# Altium project HW_ADHERENT_NFC_R1.PrjPcb
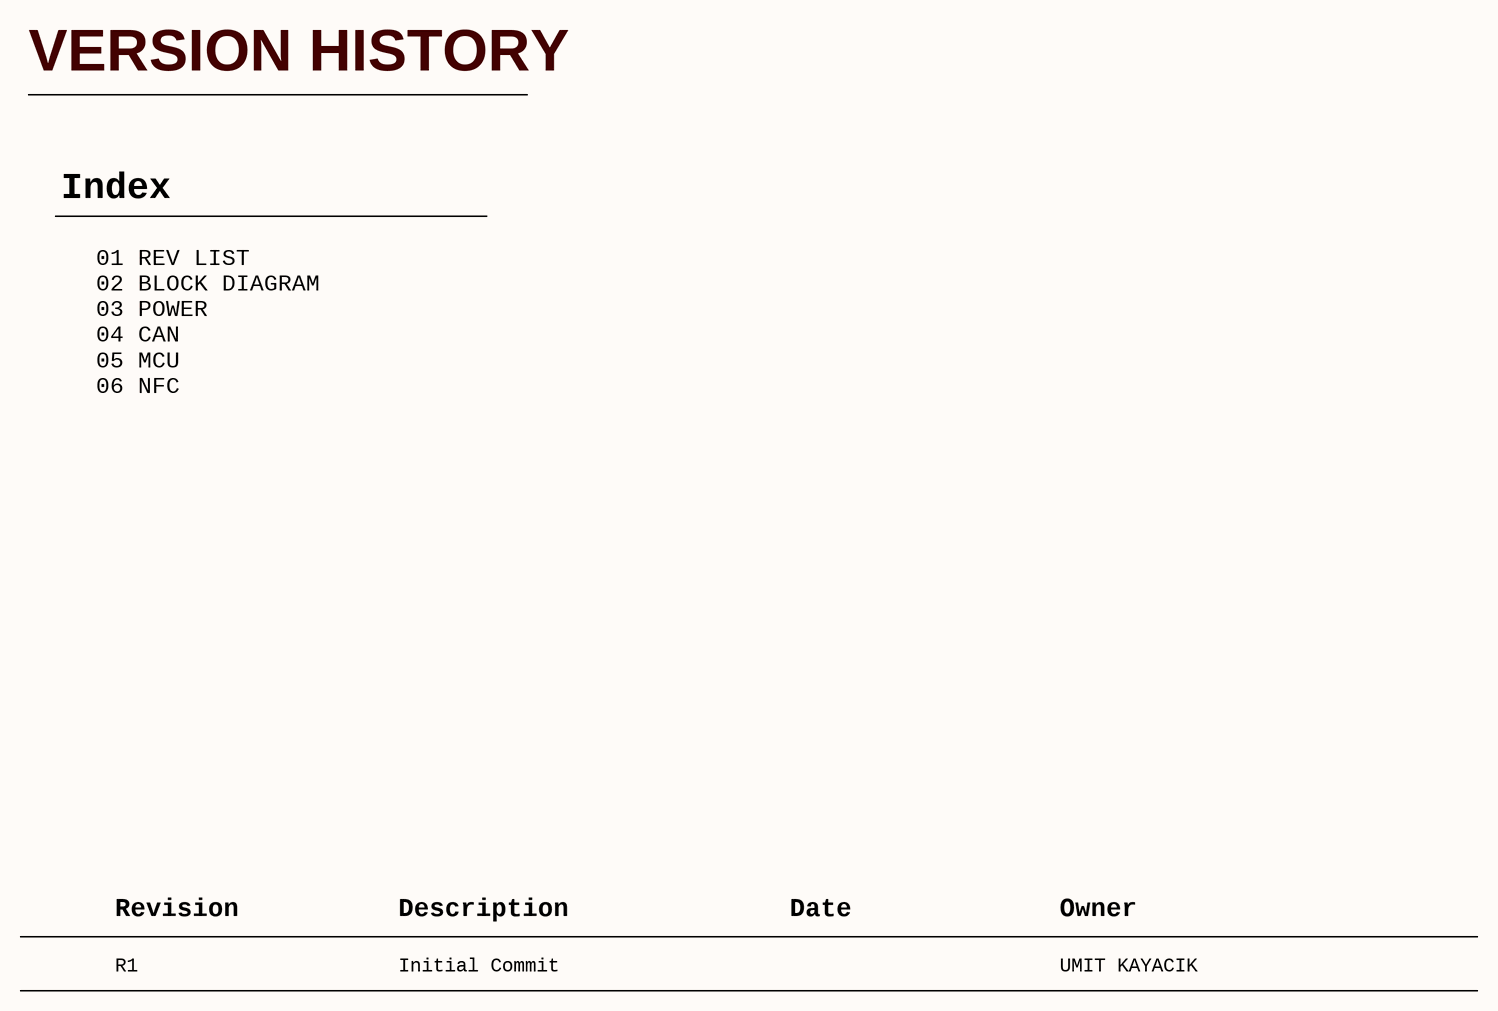
[diagram p0: 01_REVISION_HISTORY.SchDoc]
Project: HW_ADHERENT_NFC_R1; Title: HW_ADHERENT_NFC_R1; TitleParameter: HW_ADHERENT_NFC_R1
5 sheets, 115 parts. Net scope: flat (ports and power ports of the same name join across sheets).
Board file: HW_ADHERENT_NFC_R1.PcbDoc
Sheets:
  01_REVISION_HISTORY.SchDoc
  03_POWER.SchDoc
  04_CAN.SchDoc
  05_MCU.SchDoc
  06_NFC.SchDoc

## Sheet 01_REVISION_HISTORY.SchDoc: HW_ADHERENT_NFC_R1
size A3; Organization: ASISGUARD; Address1: Kemalpasa, Kemalpasa Cd. No:290 D:292H, 35060 Bornova/Izmir/Turkey

### Notes on the sheet
- VERSION HISTORY
- Index
- 01 REV LIST
  02 BLOCK DIAGRAM
  03 POWER
  04 CAN
  05 MCU
  06 NFC
- Revision
- Description
- Date
- Owner
- R1
- Initial Commit
- UMIT KAYACIK
- Proje/Project:
- Sayfa Adı/Document Name:
- Çizilme Tarihi/Drawing Date
- Umit KAYACIK
- Tasarlayan/Designed By
- Sayfa/Sheet:
- Revision:
- of
- Son Güncelleme/Last Edit Date
- Kontrol eden/Checked By
- Onaylayan/Approved By
- Boyut/Size:
- Varyant/Variant:
- Dil/Language:
- A3
- ENG

## Sheet 03_POWER.SchDoc: HW_ADHERENT_NFC_R1
size A3; Organization: ASISGUARD; Address1: Kemalpasa, Kemalpasa Cd. No:290 D:292H, 35060 Bornova/Izmir/Turkey; SheetNumber: 3; SheetTotal: 6
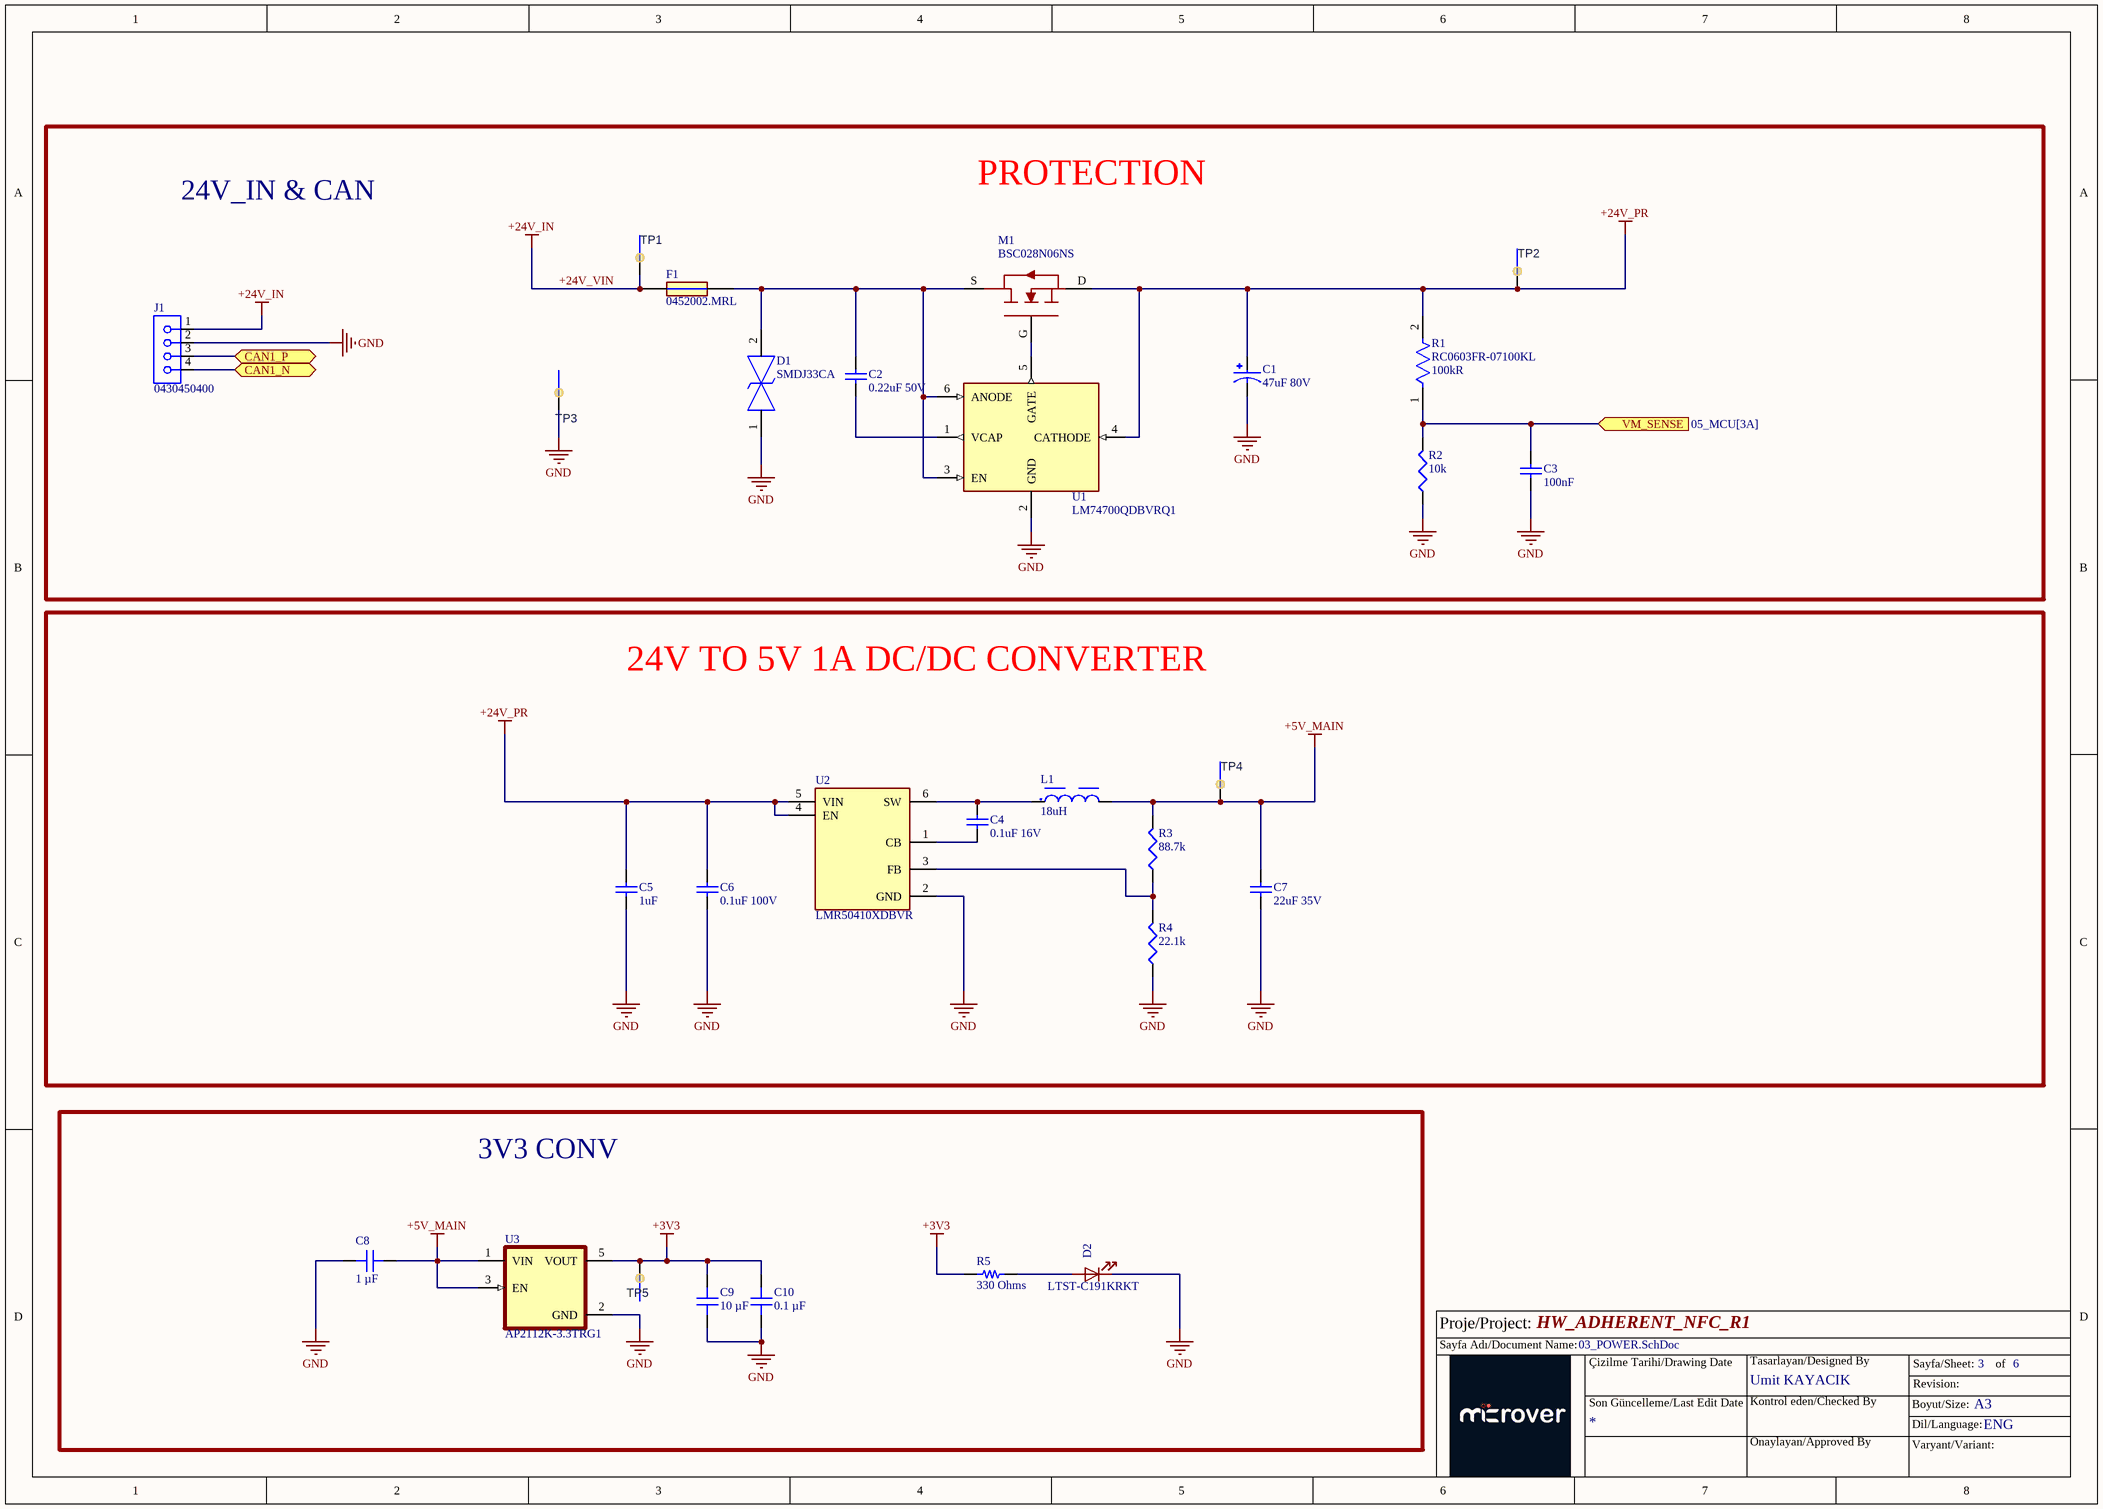
[diagram p1: 03_POWER.SchDoc]

### Parts
C1  47uF 80V  [CAP_EEEFK1K470P]
C2  value 0.22uF 50V  [SMC0603]  (hidden comment: CAP CER 0.22UF 50V X7R 0603)
C3  value 100nF  [CAP0603]  (hidden comment: 100nF 25V)
C4  0.1uF 16V  [CAP0603]
C5  1uF  [CAP0603]
C6  0.1uF 100V  [CAP0603]
C7  22uF 35V  [CAP1206]
C8  1 µF  [CAP 0603_1608]
C9  10 µF  [CAP 0805_2012]
C10  Capacitance: 0.1 µF  [CAP 0603_1608]  (hidden comment: GCM188R71H104KA57J)
D1  SMDJ33CA  [DIONM7959X262N]
D2  LTST-C191KRKT  [LED0603]
F1  0452002.MRL  [FUSC6127X294N]
J1  0430450400  [CONN_SD-43045-001_04_MOL]
L1  18uH  [WE-LQS_6045]
M1  BSC028N06NS  [BSC028N06NS]
R1  RC0603FR-07100KL  Resistance: 100kR  [FP-RC0603-0_55-MFG]
R2  value 10k  [RES0603]  (hidden comment: RES 10K OHM 1% 1/8W 0603)
R3  88.7k  [RES0603]
R4  22.1k  [RES0603]
R5  330 Ohms  [RES 0603_1608]
TP1  Testpoint  [SMD_1P5mm]  (value not drawn)  (no BOM)
TP2  Testpoint  [SMD_1P5mm]  (value not drawn)  (no BOM)
TP3  Testpoint  [SMD_1P5mm]  (value not drawn)  (no BOM)
TP4  Testpoint  [SMD_1P5mm]  (value not drawn)  (no BOM)
TP5  Testpoint  [SMD_1P5mm]  (value not drawn)  (no BOM)
U1  LM74700QDBVRQ1  [SOT95P280X145-6N/LM74700QDBVRQ1]
U2  LMR50410XDBVR  [SOT95P280X145-6N/]
U3  AP2112K-3.3TRG1  [SOT95P285X140-5N]

### Blocks framed on the sheet
PROTECTION: C1-C3 D1 F1 J1 M1 R1 R2 TP1-TP3 U1
24V TO 5V 1A DC/DC CONVERTER: C4-C7 L1 R3 R4 TP4 U2
3V3 CONV: C8-C10 D2 R5 TP5 U3

### Ports
CAN1_N (bidir, see 04_CAN[8B]), CAN1_P (bidir, see 04_CAN[8B]), VM_SENSE (in, see 05_MCU[3A])

### Nets
+3V3: C9.2 C10.2 R5.1 TP5.1(TP) U3.5(VOUT)
+5V_MAIN: C7.2 C8.2 L1.2 R3.2 TP4.1(TP) U3.1(VIN) U3.3(EN)
+24V_PR: C1.1 C5.2 C6.2 M1.D R1.2 TP2.1(TP) U1.4(CATHODE) U2.4(EN) U2.5(VIN)
+24V_VIN: F1.1 J1.1 TP1.1(TP)  [also labelled +24V_IN]
GND: C1.2 C3.1 C5.1 C6.1 C7.1 C8.1 C9.1 C10.1 D1.1 D2.2(K) J1.2 R2.1 R4.1 TP3.1(TP) U1.2(GND) U2.2(GND) U3.2(GND)
CAN1_N: J1.4 ; port CAN1_N
CAN1_P: J1.3 ; port CAN1_P
NetC2_1: C2.1 U1.1(VCAP)
NetC2_2: C2.2 D1.2 F1.2 M1.S U1.3(EN) U1.6(ANODE)
NetC3_2: C3.2 R1.1 R2.2 ; port VM_SENSE
NetC4_1: C4.1 U2.1(CB)
NetC4_2: C4.2 L1.1 U2.6(SW)
NetD2_1: D2.1(A) R5.2
NetM1_G: M1.G U1.5(GATE)
NetR3_1: R3.1 R4.2 U2.3(FB)

### Notes on the sheet
- 24V_IN & CAN
- Proje/Project:
- Sayfa Adı/Document Name:
- Çizilme Tarihi/Drawing Date
- Umit KAYACIK
- Tasarlayan/Designed By
- Sayfa/Sheet:
- Revision:
- of
- Son Güncelleme/Last Edit Date
- Kontrol eden/Checked By
- Onaylayan/Approved By
- Boyut/Size:
- Varyant/Variant:
- Dil/Language:
- A3
- ENG

### Library data of the parts
C1 = EEE-FK1K470P: 47 µF 80 V Aluminum Electrolytic Capacitors Radial, Can - SMD 2000 Hrs @ 105°C; Manufacturer: Panasonic Industry; Supplier: Digi; PCE3831DKR-ND
C2 = CAP0603_0.22UF_50V: 0.22 µF ±10% 50V Ceramic Capacitor X7R 0603 (1608 Metric); Manufacturer Part Number: GCM188R71H224KA64D; Order Code: DIGI: 490-5402-2-ND
C3 = CAP0603_100nF: 0.1 µF ±10% 50V Ceramic Capacitor X7R 0603 (1608 Metric); Manufacturer Part Number: CL10B104KA8NNNC; LCSC Part Number: C1590
C4 = C0603C104M4RACTU: 0.1 µF ±20% 16V Ceramic Capacitor X7R 0603 (1608 Metric); Manifacturer: KEMET; Supplier: Digi; 399-C0603C104M4RACTUDKR-ND
C5 = MSASU168SB5105MTNA01: CAP CER 1UF 50V X5R 0603; Manufacturer: Taiyo Yuden; Supplier: 587-MSASU168SB5105MTNA01DKR-ND
C6 = GRM188R72A104KA35D: CAP CER 0.1UF 100V X7R 0603; Manifacturer: Murata Electronics; Supplier: Digi; 490-3285-6-ND
C7 = CAP1206_22uF_35V: 22 µF ±20% 35V Ceramic Capacitor X5R 1206 (3216 Metric); Manufacturer Part Number: C3216X5R1V226M160AC; Order Code: DIGI : 445-180362-1-ND; Value: 22uF 35V
C8 = GMC10X7R105K25NT: CAP0603 X7R 1UF 10% 25V; manufacturer: Cal-Chip Electronics, Inc.; Part Number: GMC10X7R105K25NT; Capacitance: 1 µF; Applications: General Purpose; componentlink1description: Datasheet; componentlink1url: https://calchip.com/wp-content/uploads/2023/05/gmc_series.pdf; componentlink2description: DigiKey Link; componentlink2url: https://www.digikey.com/en/products/detail/cal-chip-electronics-inc/GMC10X7R105K25NT/22461338; Device Package: 0603 (1608 Metric); lastupdated: 4/6/2026 7:18:33 PM; Lifecycle Status: Active; Minimum Order: 1; Mounting Type: Surface Mount, MLCC; Operating Temperature: -55°C ~ 125°C; Package / Case: 0603 (1608 Metric); packaging: TapeAndReel; partid: 68086; price: 0.01; series: GMC; Size / Dimension: 0.063" L x 0.031" W (1.60mm x 0.80mm); Supplier 1: DigiKey; Supplier Part Number 1: 4713-GMC10X7R105K25NTCT-ND; Temperature Coefficient: X7R; Thickness (Max): 0.037" (0.95mm); Tolerance: ±10%; value: 1 µF; Voltage - Rated: 25V
C9 = GRM21BR61H106KE43L: CAP CER 10UF 50V X5R 0805; manufacturer: Murata Electronics; Tolerance: ±10%; Part Number: GRM21BR61H106KE43L; Capacitance: 10 µF; Applications: Mobile Devices Only; componentlink1description: Datasheet; componentlink1url: https://search.murata.co.jp/Ceramy/image/img/A01X/G101/ENG/GRM21BR61H106KE43-01A.pdf; componentlink2description: DigiKey Link; componentlink2url: https://www.digikey.com/en/products/detail/murata-electronics/GRM21BR61H106KE43L/10326316; Device Package: 0805 (2012 Metric); lastupdated: 4/6/2026 7:32:58 PM; Lifecycle Status: Active; Minimum Order: 1; Mounting Type: Surface Mount, MLCC; Operating Temperature: -55°C ~ 85°C; Package / Case: 0805 (2012 Metric); packaging: TapeAndReel; partid: 39284; Part Status: Active; price: 0.04; series: GRM; Size / Dimension: 0.079" L x 0.049" W (2.00mm x 1.25mm); Supplier 1: DigiKey; Supplier Part Number 1: 490-18663-1-ND; Temperature Coefficient: X5R; Thickness (Max): 0.057" (1.45mm); value: 10 µF; Voltage - Rated: 50V
C10 = GCM188R71H104KA57J: CAP CER 0.1UF 50V X7R 0603; manufacturer: Murata Electronics; Tolerance: ±10%; Part Number: GCM188R71H104KA57J; Applications: Automotive; componentlink1description: Datasheet; componentlink1url: https://psearch.en.murata.com/capacitor/product/GCM188R71H104KA57%23.pdf; componentlink2description: DigiKey Link; componentlink2url: https://www.digikey.com/en/products/detail/murata-electronics/GCM188R71H104KA57J/2591942; Device Package: 0603 (1608 Metric); lastupdated: 4/6/2026 7:22:36 PM; Lifecycle Status: Active; Minimum Order: 1; Mounting Type: Surface Mount, MLCC; Operating Temperature: -55°C ~ 125°C; Package / Case: 0603 (1608 Metric); packaging: TapeAndReel; partid: 60442; Part Status: Not For New Designs; price: 0.03; Ratings: AEC-Q200; series: GCM; Size / Dimension: 0.063" L x 0.031" W (1.60mm x 0.80mm); Supplier 1: DigiKey; Supplier Part Number 1: 490-8020-1-ND; Temperature Coefficient: X7R; Thickness (Max): 0.035" (0.90mm); Voltage - Rated: 50V
D1 = SMDJ33CA: 53.3V Clamp 56.3A Ipp Tvs Diode Surface Mount DO-214AB (SMCJ); Manufacturer: Littelfuse Inc.; Supplier: Digi; SMDJ33CADKR-ND
D2 = LED_1: LED RED CLEAR SMD; Manufacturer: Lite-On Inc.; Value: LTST-C191KRKT; Footprint: LED_SMD:LED_0603_1608Metric; Manufacturer Part Number: LTST-C191KRKT; Supplier Part Number: 160-1447-1-ND
F1 = 0452002.MRL: 2 A 125 V 125 V Fuse Board Mount (Cartridge Style Excluded) Surface Mount 2-SMD, Square End Block; Manufacturer: Littelfuse Inc.; Supplier: Digi; F2602DKR-ND
J1 = 0430450400: Connector Header Through Hole, Right Angle 4 position 0.118" (3.00mm); Manifacturer: MOLEX; Supplier: Digi; WM1814-ND
L1 = 74404064180: 18 µH Semi-Shielded Drum Core, Wirewound Inductor 2.2 A 81mOhm Nonstandard; Supplier: 732-5553-6-ND
M1 = BSC028N06NS: MOSFET'ler N-Ch 60V 100A TDSON-8 OptiMOS 3
R1 = CMP-2100-03662-2: RES SMD 100K OHM 1% 1/10W 0603; Voltage Rating (DC): 50V; Max Power Dissipation: 100mW; Temperature Coefficient: 100ppm/°C; Working Voltage: 75V; Length: 1.6mm; Lead Free: Lead Free; Number of Terminations: 2; Packaging: Tape and Reel; Voltage Rating: 50V; Termination: SMD/SMT; Width: 0.8mm; Resistor Type: Thick Film; Resistance Tolerance: 1%; Features: Moisture Resistant; Height: 0.45mm; Construction: Rectangular; Case/Package: 0603; Military Standard: Not; Case Code (Imperial): 0603; Series: RC; Technology: THICK FILM; Depth: 0.8mm; RoHS Compliant: Yes; REACH SVHC: No SVHC; Min Operating Temperature: -55°C; Case Code (Metric): 1608; Max Operating Temperature: 155°C; Power Rating: 100mW; Number of Pins: 2; Tolerance: 1%
R2 = RES0603_10K_%1_1: 10 kOhms ±1% 0.125W, 1/8W Chip Resistor 0603 (1608 Metric) Anti-Sulfur Thin Film; Manufacturer Part Number: RNCP0603FTD10K0; LCSC Manufacturer Part Number: MCT06030C1002FP500; Order Code: Digi: RNCP0603FTD10K0TR-ND; Sirius Stock Code: *; LCSC Part Number: C161803
R3 = CRCW060388K7FKEA: 88.7 kOhms ±1% 0.125W, 1/8W Chip Resistor 0603 (1608 Metric) Automotive AEC-Q200 Thick Film
R4 = RC0603FR-0722K1L: 22.1 kOhms ±1% 0.1W, 1/10W Chip Resistor 0603 (1608 Metric) Moisture Resistant Thick Film
R5 = CRGH0603F330R: RES SMD 330 OHM 1% 1/5W 0603; Manufacturer: TE Connectivity Passive Product; Power (Watts): 0.2W, 1/5W; Temperature Coefficient: ±100ppm/°C; Part Number: CRGH0603F330R; Value: 330 Ohms; ComponentLink1Description: Datasheet; ComponentLink1URL: https://www.te.com/commerce/DocumentDelivery/DDEController?Action=srchrtrv&DocNm=1773204-1&DocType=DS&DocLang=English; ComponentLink2Description: DigiKey Link; ComponentLink2URL: https://www.digikey.com/en/products/detail/te-connectivity-passive-product/CRGH0603F330R/5586961; Composition: Thick Film; Device Package: 0603 (1608 Metric); Height - Seated (Max): 0.022" (0.55mm); LastUpdated: 2/9/2024 8:43:33 PM; Lifecycle Status: Active; Minimum Order: 1; Number of Terminations: 2; Operating Temperature: -55°C ~ 155°C; Package / Case: 0603 (1608 Metric); Packaging: TapeAndReel; PartId: 5733; Part Status: Active; Price: 0.01; Resistance: 330 Ohms; Series: CRGH, Neohm; Size / Dimension: 0.063" L x 0.031" W (1.60mm x 0.80mm); Supplier 1: DigiKey; Supplier Part Number 1: A129541CT-ND; Supplier Device Package: 0603; Tolerance: ±1%
TP1-TP5 = Testpoint / 1.0mm Pad / TP100: Testpoint / 2.0mm Pad / TP200; Value: Testpoint; DNP: DNP
U1 = LM74700QDBVRQ1: OR Controller N+1 ORing Controller N-Channel 1:1 SOT-23-6
U2 = LMR50410XDBVR: Buck Switching Regulator IC Positive Adjustable 1V 1 Output 1A SOT-23-6; Supplier: 296-LMR50410XDBVRDKR-ND; MPN: LMR50410XDBVR
U3 = AP2112K-3.3TRG1: Linear Voltage Regulator IC Positive Fixed 1 Output 600mA SOT-25; MF: Diodes Inc.; Value: *; Purchase-URL: https://pricing.snapeda.com/search/part/AP2112K-3.3TRG1/?ref=eda; Package: SOT-753 Diodes Inc.; Availability: In Stock; Check_prices: https://www.snapeda.com/parts/AP2112K-3.3TRG1/Diodes+Inc./view-part/?ref=eda; Price: None; SnapEDA_Link: https://www.snapeda.com/parts/AP2112K-3.3TRG1/Diodes+Inc./view-part/?ref=snap; MP: AP2112K-3.3TRG1

## Sheet 04_CAN.SchDoc: HW_ADHERENT_NFC_R1
size A3; Organization: ASISGUARD; Address1: Kemalpasa, Kemalpasa Cd. No:290 D:292H, 35060 Bornova/Izmir/Turkey; SheetNumber: 4; SheetTotal: 6
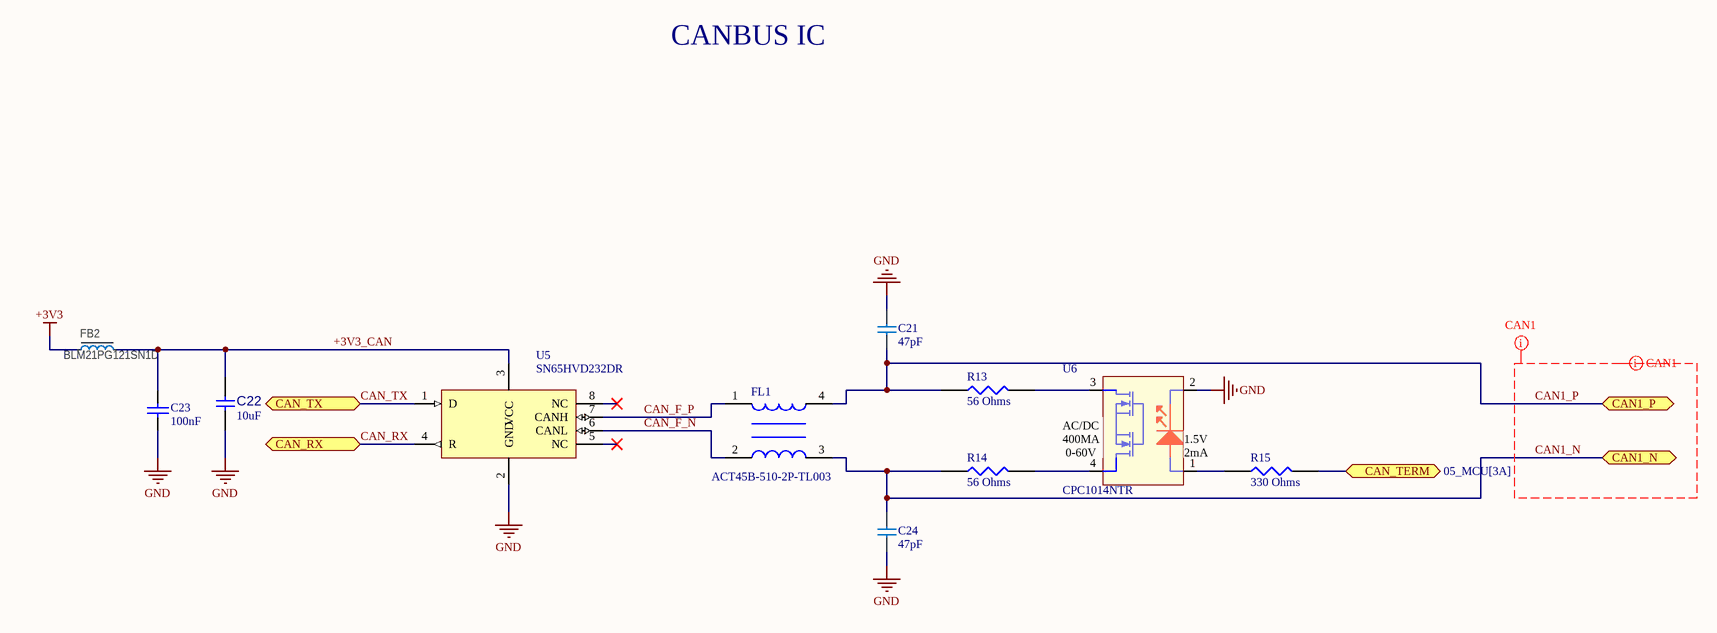
[diagram p2: 04_CAN.SchDoc]

### Parts
C21  47pF  [CAPC1608X100N]
C22  10uF  [0603_C]
C23  100nF  [CAP0603]
C24  47pF  [CAPC1608X100N]
FB2  BLM21PG121SN1D  [INDC2012X11L]
FL1  ACT45B-510-2P-TL003  [FIL_ACT45B-510-2P-TL003]
R13  56 Ohms  [RES_0402]
R14  56 Ohms  [RES_0402]
R15  330 Ohms  [RES_0402]
U5  SN65HVD232DR  [SOIC8]
U6  CPC1014NTR  [4-SOP]

### Ports
CAN1_N (bidir, see 03_POWER[1A]), CAN1_P (bidir, see 03_POWER[1A]), CAN_RX (bidir, see 05_MCU[3A]), CAN_TERM (bidir, see 05_MCU[3A]), CAN_TX (bidir, see 05_MCU[3A])

### Nets
+3V3: FB2.1
GND: C21.2 C22.1 C23.2 C24.1 U5.2(GND) U6.2(CATHODE1)
+3V3_CAN: C22.2 C23.1 FB2.2 U5.3(VCC)
CAN1_N: C24.2 FL1.3 R14.1 ; port CAN1_N
CAN1_P: C21.1 FL1.4 R13.1 ; port CAN1_P
CAN_F_N: FL1.2 U5.6(CANL)
CAN_F_P: FL1.1 U5.7(CANH)
CAN_RX: U5.4(R) ; port CAN_RX
CAN_TX: U5.1(D) ; port CAN_TX
NetR13_2: R13.2 U6.3
NetR14_2: R14.2 U6.4
NetR15_1: R15.1 U6.1(ANODE)
NetR15_2: R15.2 ; port CAN_TERM

Not connected (* = marked no-connect by the designer): U5 5(NC)* 8(NC)*

### Layout directives
net class CAN1: CAN1_N, CAN1_P
differential pair; differential pair class ZDIFF120; net class CAN_BUS: CAN1_N, CAN1_P

### Notes on the sheet
- CANBUS IC
- Proje/Project:
- Sayfa Adı/Document Name:
- Çizilme Tarihi/Drawing Date
- Umit KAYACIK
- Tasarlayan/Designed By
- Sayfa/Sheet:
- Revision:
- of
- Son Güncelleme/Last Edit Date
- Kontrol eden/Checked By
- Onaylayan/Approved By
- Boyut/Size:
- Varyant/Variant:
- Dil/Language:
- A3
- ENG
- (in symbol CPC1014NTR) AC/DC / 400MA / 0-60V; 1.5V / 2mA /

### Library data of the parts
C21 C24 = GMC10CG470F200NT: 47 pF ±1% 200V Ceramic Capacitor C0G, NP0 0603 (1608 Metric); Manufacturer: Cal-Chip Electronics, Inc.; MPN: GMC10CG470F200NT; Supplier: 4713-GMC10CG470F200NTDKR-ND
C22 = CAP1461: CAP CER 10UF 25V X5R 0603; Manufacturer: Murata Electronics North America; Manufacturer Part Number: GRM188R61E106MA73D; Value: 10uF; Voltage: 25V; Revision: 1; Supplier Part Number: 490-7202-1-ND
C23 = CAP0603_100nF: CAP CER 0.1UF 50V X7R 0603; P/N: C0603C104K5RACTU; Value: 100nF 50V; Order Code: DIGI : 399-5089-1-ND
FB2 = FB0402-120R@100M-500mA: Ferrite Bead, 120 Ohm @ 100MHz, 500mA, 250 mOhm Max; Manufacturer: Murata; Manufacturer Part Number: BLM15AG121SN1D; Part number IPS: 00000009954; Part number Norautron: 265230631; Part number NEMS: 100300099; Value: 120R/0.55A; Note: Chip EMIFIL Inductor Type Chip Ferrite Bead; Artikkelnr Noca: 33029317; Pad Count: 2; Component Status: Active; Part Number: FB0402-120R@100M-500mA; Footprint Doc: 0402; LatestRevisionDate: 2014-01-10; Published: 2011-11-14; ComponentLink1Description: Datasheet; ComponentLink2Description: Supplier link; ComponentLink1URL: N.A.; ComponentLink2URL: N.A.; HelpURL: http://search.murata.co.jp/Ceramy/image/img/PDF/ENG/L0110S0100BLM15A_SN.pdf; Supplier 1: Digi-Key; Supplier Part Number 1: 490-1005-1-ND; Supplier 2: Farnell; Supplier Part Number 2: 151-5760; Component Class: Inductors; PartId: 100300099; Author: rsk
FL1 = ACT45B-510-2P-TL003: 51 ÂµH @ 100 kHz 2 Line Common Mode Choke Surface Mount 2.8 kOhms @ 10 MHz 200mA DCR 1Ohm; MF: TDK; SnapEDA_Link: https://www.snapeda.com/parts/ACT45B-510-2P-TL003/TDK/view-part/?ref=snap; Package: Horizontal-4 TDK; Value: *; MP: ACT45B-510-2P-TL003; Check_prices: https://www.snapeda.com/parts/ACT45B-510-2P-TL003/TDK/view-part/?ref=eda
R13 R14 = RMCF0402FT56R0: 56 Ohms ±1% 0.063W, 1/16W Chip Resistor 0402 (1005 Metric) Automotive AEC-Q200 Thick Film; Manİfacturer: Stackpole Electronics Inc; Supplier: Digi; RMCF0402FT56R0DKR-ND
R15 = RMCF0402FT330R: 330 Ohms ±1% 0.063W, 1/16W Chip Resistor 0402 (1005 Metric) Automotive AEC-Q200 Thick Film; Manifacturer: Stackpole Electronics Inc; Supplier: Digi; RMCF0402FT330RDKR-ND
U5 = SN65HVD232DR: 1Mbps Transceiver 3V~3.6V SOIC-8 CAN ICs ROHS; Manufacturer Part Number: SN65HVD232DR; LCSC Part Number: C30530
U6 = CPC1014NTR: SSR RELAY SPST-NO 400MA 0-60V; Manufacturer: IXYS Integrated Circuits Division; Manufacturer Part Number: CPC1014NTR; Supplier Part Number: CLA314CT-ND

## Sheet 05_MCU.SchDoc: HW_ADHERENT_NFC_R1
size A3; Organization: ASISGUARD; Address1: Kemalpasa, Kemalpasa Cd. No:290 D:292H, 35060 Bornova/Izmir/Turkey; SheetNumber: 5; SheetTotal: 6
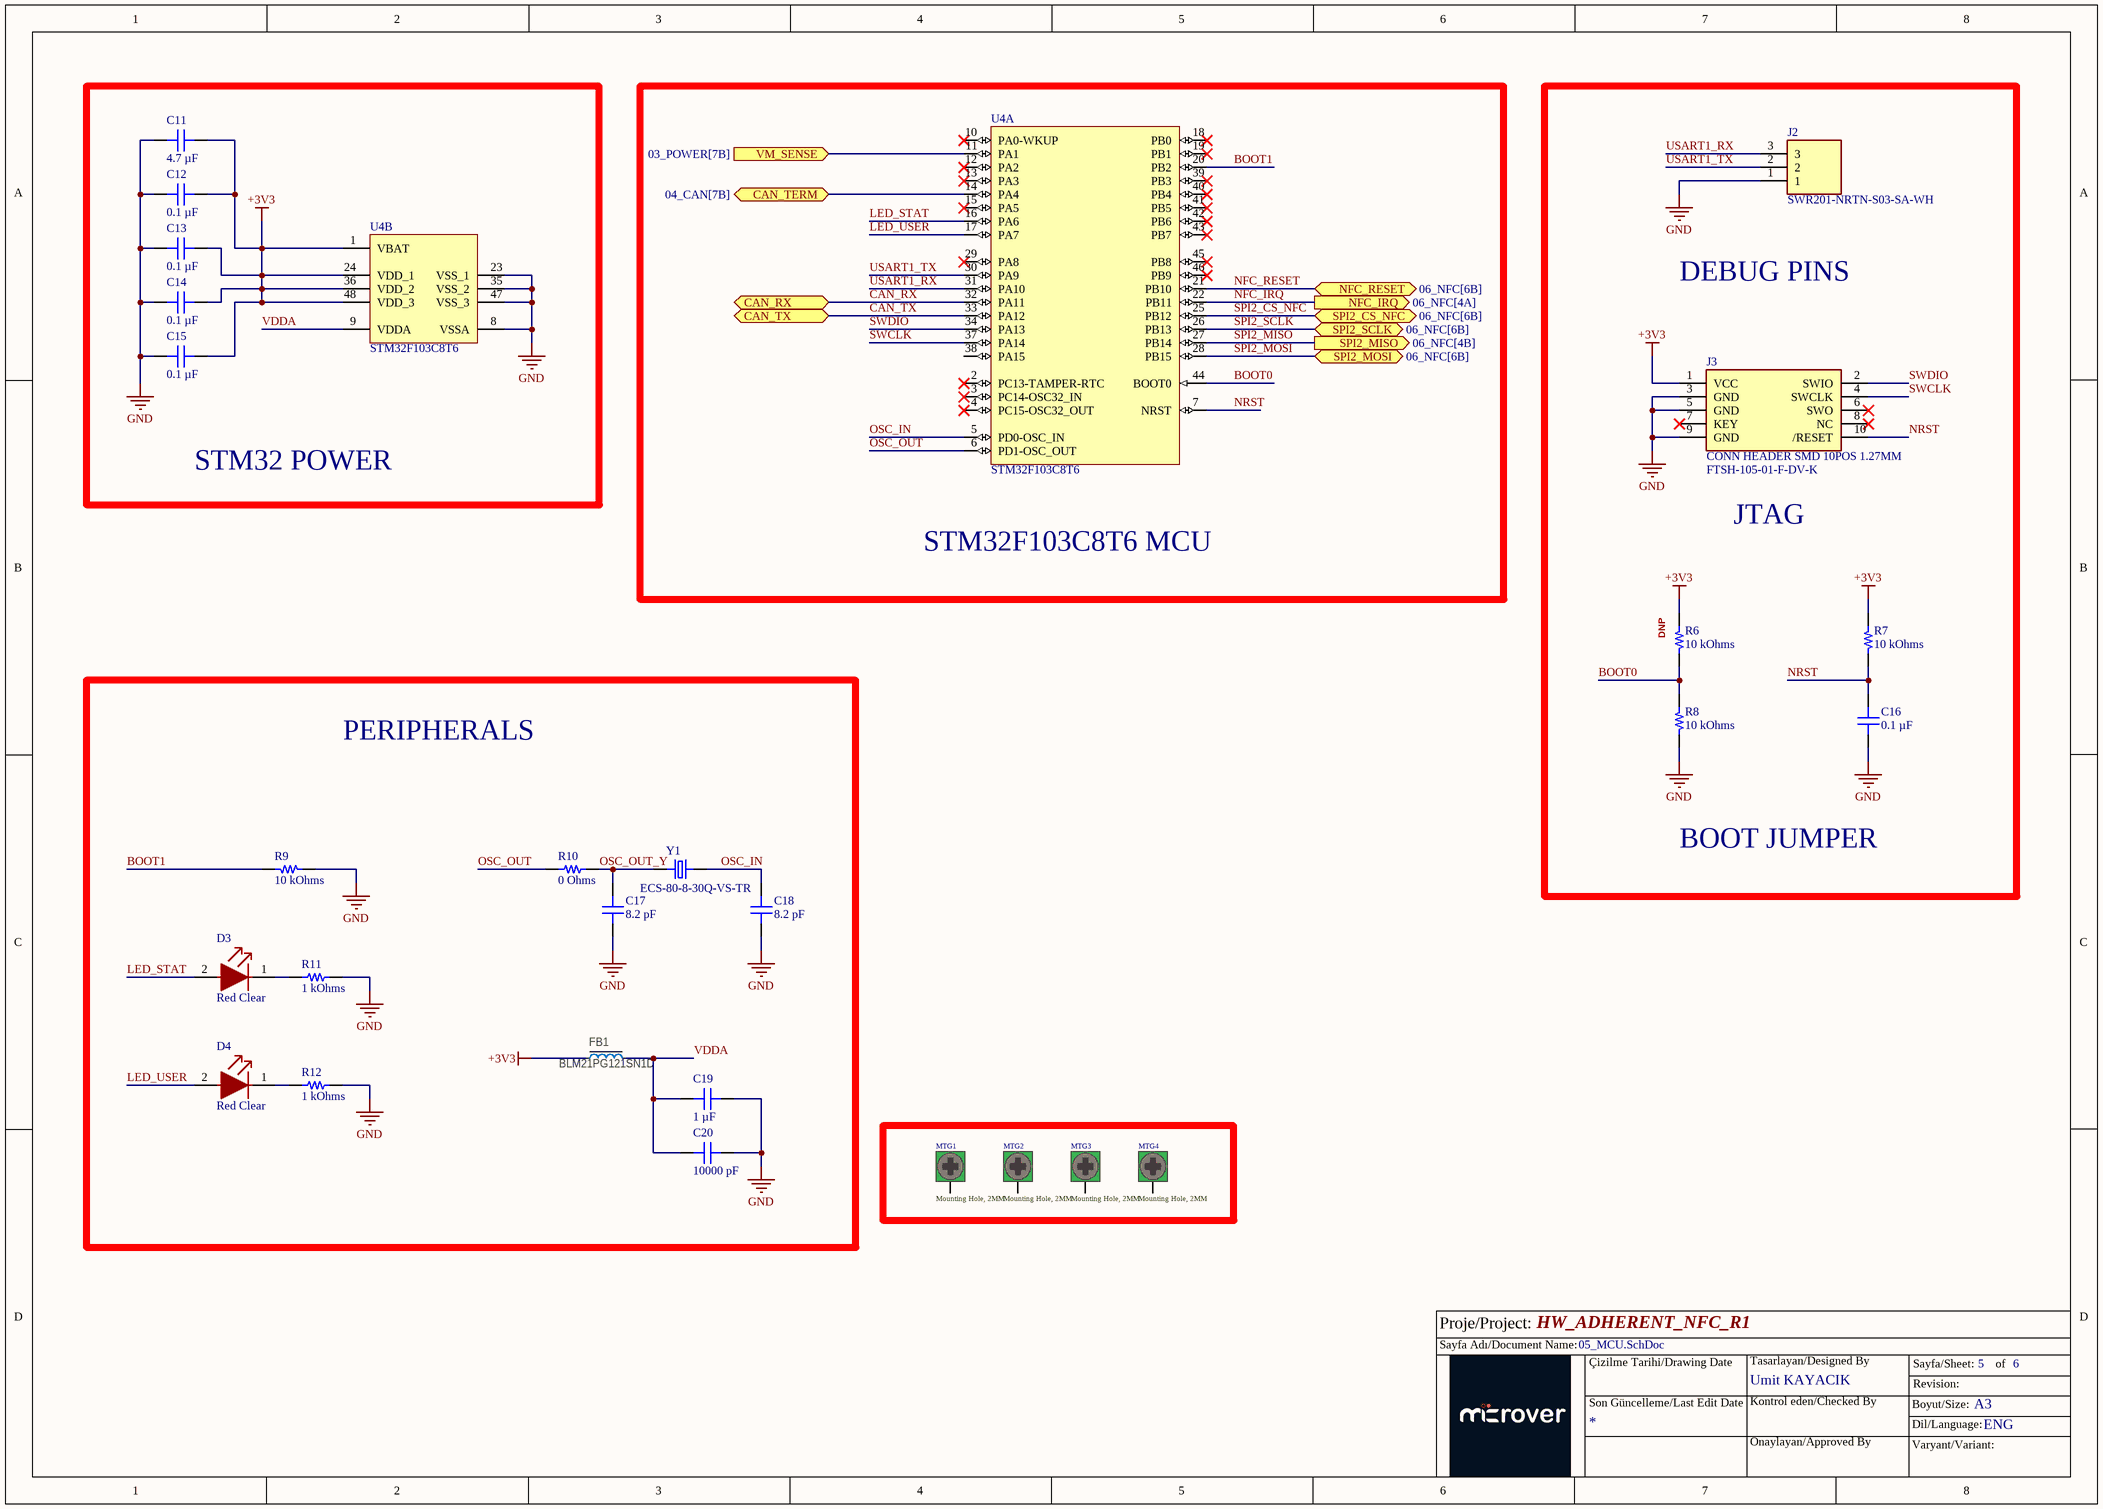
[diagram p3: 05_MCU.SchDoc]

### Parts
C11  4.7 µF  [CAP 0805_2012]
C12  Capacitance: 0.1 µF  [CAP 0603_1608]  (hidden comment: GCM188R71H104KA57J)
C13  Capacitance: 0.1 µF  [CAP 0603_1608]  (hidden comment: GCM188R71H104KA57J)
C14  Capacitance: 0.1 µF  [CAP 0603_1608]  (hidden comment: GCM188R71H104KA57J)
C15  Capacitance: 0.1 µF  [CAP 0603_1608]  (hidden comment: GCM188R71H104KA57J)
C16  Capacitance: 0.1 µF  [CAP 0603_1608]  (hidden comment: GCM188R71H104KA57J)
C17  8.2 pF  [CAP 0402_1005]
C18  8.2 pF  [CAP 0402_1005]
C19  1 µF  [CAP 0603_1608]
C20  10000 pF  [CAP 0603_1608]
D3  Color: Red Clear  [Lite-On_RED_0603]  (hidden comment: LED RED CLEAR SMD)
D4  Color: Red Clear  [Lite-On_RED_0603]  (hidden comment: LED RED CLEAR SMD)
FB1  BLM21PG121SN1D  [INDC2012X11L]
J2  SWR201-NRTN-S03-SA-WH  [SHDR3W50P0X200_1X3_790X460X630P]
J3  CONN HEADER SMD 10POS 1.27MM  [Samtec_0_MFG]
MTG1  Mounting Hole, 2MM  [MTG-PTH-2MM]  (no BOM)
MTG2  Mounting Hole, 2MM  [MTG-PTH-2MM]  (no BOM)
MTG3  Mounting Hole, 2MM  [MTG-PTH-2MM]  (no BOM)
MTG4  Mounting Hole, 2MM  [MTG-PTH-2MM]  (no BOM)
R6  10 kOhms  [RES 0402_1005]
R7  10 kOhms  [RES 0402_1005]
R8  10 kOhms  [RES 0402_1005]
R9  10 kOhms  [RES 0402_1005]
R10  0 Ohms  [RES 0402_1005]
R11  1 kOhms  [RES 0402_1005]
R12  1 kOhms  [RES 0402_1005]
U4  STM32F103C8T6  [LQFP48_STM]  (parts A,B of 2)
Y1  ECS-80-8-30Q-VS-TR  [XTAL_ECS-80-8-30Q-VS-TR]

### Blocks framed on the sheet
STM32 POWER: C11-C15 U4
STM32F103C8T6 MCU: U4
PERIPHERALS: C17-C20 D3 D4 FB1 R9-R12 Y1

### Ports
CAN_RX (bidir, see 04_CAN[2B]), CAN_TERM (bidir, see 04_CAN[7B]), CAN_TX (bidir, see 04_CAN[2B]), NFC_IRQ (out, see 06_NFC[4A]), NFC_RESET (bidir, see 06_NFC[6B]), SPI2_CS_NFC (bidir, see 06_NFC[6B]), SPI2_MISO (out, see 06_NFC[4B]), SPI2_MOSI (bidir, see 06_NFC[6B]), SPI2_SCLK (bidir, see 06_NFC[6B]), VM_SENSE (in, see 03_POWER[7B])

### Nets
+3V3: C11.2 C12.1 C13.1 C14.1 C15.1 FB1.1 J3.1(VCC) R6.1 R7.1 U4.1(VBAT) U4.24(VDD_1) U4.36(VDD_2) U4.48(VDD_3)
GND: C11.1 C12.2 C13.2 C14.2 C15.2 C16.2 C17.1 C18.1 C19.2 C20.2 J2.1 J3.3(GND) J3.5(GND) J3.9(GND) R8.2 R9.1 R11.2 R12.2 U4.8(VSSA) U4.23(VSS_1) U4.35(VSS_2) U4.47(VSS_3)
BOOT0: R6.2 R8.1 U4.44(BOOT0)
BOOT1: R9.2 U4.20(PB2)
CAN_RX: U4.32(PA11) ; port CAN_RX
CAN_TX: U4.33(PA12) ; port CAN_TX
LED_STAT: D3.2(A) U4.16(PA6)
LED_USER: D4.2(A) U4.17(PA7)
NFC_IRQ: U4.22(PB11) ; port NFC_IRQ
NFC_RESET: U4.21(PB10) ; port NFC_RESET
NRST: C16.1 J3.10(/RESET) R7.2 U4.7(NRST)
OSC_IN: C18.2 U4.5(PD0-OSC_IN) Y1.2(OUT/IN)
OSC_OUT: R10.1 U4.6(PD1-OSC_OUT)
OSC_OUT_Y: C17.2 R10.2 Y1.1(IN/OUT)
SPI2_CS_NFC: U4.25(PB12) ; port SPI2_CS_NFC
SPI2_MISO: U4.27(PB14) ; port SPI2_MISO
SPI2_MOSI: U4.28(PB15) ; port SPI2_MOSI
SPI2_SCLK: U4.26(PB13) ; port SPI2_SCLK
SWCLK: J3.4(SWCLK) U4.37(PA14)
SWDIO: J3.2(SWIO) U4.34(PA13)
USART1_RX: J2.3 U4.31(PA10)
USART1_TX: J2.2 U4.30(PA9)
VDDA: C19.1 C20.1 FB1.2 U4.9(VDDA)
NetC3_2: U4.11(PA1) ; port VM_SENSE
NetD3_1: D3.1(C) R11.1
NetD4_1: D4.1(C) R12.1
NetR15_2: U4.14(PA4) ; port CAN_TERM

Not connected (* = marked no-connect by the designer): J3 6(SWO)* 7(KEY)* 8(NC)*; MTG1 0; MTG2 0; MTG3 0; MTG4 0; U4 2(PC13-TAMPER-RTC)* 3(PC14-OSC32_IN)* 4(PC15-OSC32_OUT)* 10(PA0-WKUP)* 12(PA2)* 13(PA3)* 15(PA5)* 18(PB0)* 19(PB1)* 29(PA8)* 38(PA15) 39(PB3)* 40(PB4)* 41(PB5)* 42(PB6)* 43(PB7)* 45(PB8)* 46(PB9)*

### Notes on the sheet
- DEBUG PINS
- JTAG
- (near R6) DNP
- BOOT JUMPER
- Proje/Project:
- Sayfa Adı/Document Name:
- Çizilme Tarihi/Drawing Date
- Umit KAYACIK
- Tasarlayan/Designed By
- Sayfa/Sheet:
- Revision:
- of
- Son Güncelleme/Last Edit Date
- Kontrol eden/Checked By
- Onaylayan/Approved By
- Boyut/Size:
- Varyant/Variant:
- Dil/Language:
- A3
- ENG

### Library data of the parts
C11 = GRM21BZ71H475KE15K: CAP CER 4.7UF 50V X7R 0805; manufacturer: Murata Electronics; Tolerance: ±10%; Part Number: GRM21BZ71H475KE15K; Capacitance: 4.7 µF; Applications: General Purpose; componentlink1description: Datasheet; componentlink1url: https://search.murata.co.jp/Ceramy/image/img/A01X/G101/ENG/GRM21BZ71H475KE15-01.pdf; componentlink2description: DigiKey Link; componentlink2url: https://www.digikey.com/en/products/detail/murata-electronics/GRM21BZ71H475KE15K/13904908; Device Package: 0805 (2012 Metric); lastupdated: 6.04.2026 19:31:51; Lifecycle Status: Active; Minimum Order: 1; Mounting Type: Surface Mount, MLCC; Operating Temperature: -55°C ~ 125°C; Package / Case: 0805 (2012 Metric); packaging: TapeAndReel; partid: 39591; Part Status: Active; price: 0.17; series: GRM; Size / Dimension: 0.079" L x 0.049" W (2.00mm x 1.25mm); Supplier 1: DigiKey; Supplier Part Number 1: 490-GRM21BZ71H475KE15KCT-ND; Temperature Coefficient: X7R; Thickness (Max): 0.057" (1.45mm); value: 4.7 µF; Voltage - Rated: 50V
C12-C16 = GCM188R71H104KA57J: as C10 on sheet 03_POWER; Part Number: GCM188R71H104KA57J; Applications: Automotive; componentlink1description: Datasheet; componentlink1url: https://psearch.en.murata.com/capacitor/product/GCM188R71H104KA57%23.pdf; componentlink2description: DigiKey Link; componentlink2url: https://www.digikey.com/en/products/detail/murata-electronics/GCM188R71H104KA57J/2591942; Device Package: 0603 (1608 Metric); lastupdated: 6.04.2026 19:22:36; Lifecycle Status: Active; Minimum Order: 1; Mounting Type: Surface Mount, MLCC; Operating Temperature: -55°C ~ 125°C; Package / Case: 0603 (1608 Metric); packaging: TapeAndReel; partid: 60442; Part Status: Not For New Designs; price: 0.03; Ratings: AEC-Q200; series: GCM; Size / Dimension: 0.063" L x 0.031" W (1.60mm x 0.80mm); Supplier 1: DigiKey; Supplier Part Number 1: 490-8020-1-ND; Temperature Coefficient: X7R; Thickness (Max): 0.035" (0.90mm); Voltage - Rated: 50V
C17 C18 = GMC04CG8R2J25NT: CAP0402 COG 8.2PF 5% 25V; manufacturer: Cal-Chip Electronics, Inc.; Temperature Coefficient: C0G, NP0; Part Number: GMC04CG8R2J25NT; Capacitance: 8.2 pF; Applications: General Purpose; componentlink1description: Datasheet; componentlink1url: https://calchip.com/wp-content/uploads/2025/05/GMC-Series-3.pdf; componentlink2description: DigiKey Link; componentlink2url: https://www.digikey.com/en/products/detail/cal-chip-electronics-inc/GMC04CG8R2J25NT/27784357; Device Package: 0402 (1005 Metric); Features: General Purpose; lastupdated: 6.04.2026 19:06:51; Lifecycle Status: Active; Minimum Order: 1; Mounting Type: Surface Mount, MLCC; Operating Temperature: -55°C ~ 125°C; Package / Case: 0402 (1005 Metric); packaging: TapeAndReel; partid: 61382; price: 0.07; series: GMC; Size / Dimension: 0.039" L x 0.020" W (1.00mm x 0.50mm); Supplier 1: DigiKey; Supplier Part Number 1: 4713-GMC04CG8R2J25NTCT-ND; Thickness (Max): 0.022" (0.55mm); Tolerance: ±5%; value: 8.2 pF; Voltage - Rated: 25V
C19 = GMC10X7R105K25NT: as C8 on sheet 03_POWER; Part Number: GMC10X7R105K25NT; Capacitance: 1 µF; Applications: General Purpose; componentlink1description: Datasheet; componentlink1url: https://calchip.com/wp-content/uploads/2023/05/gmc_series.pdf; componentlink2description: DigiKey Link; componentlink2url: https://www.digikey.com/en/products/detail/cal-chip-electronics-inc/GMC10X7R105K25NT/22461338; Device Package: 0603 (1608 Metric); lastupdated: 6.04.2026 19:18:33; Lifecycle Status: Active; Minimum Order: 1; Mounting Type: Surface Mount, MLCC; Operating Temperature: -55°C ~ 125°C; Package / Case: 0603 (1608 Metric); packaging: TapeAndReel; partid: 68086; price: 0.01; series: GMC; Size / Dimension: 0.063" L x 0.031" W (1.60mm x 0.80mm); Supplier 1: DigiKey; Supplier Part Number 1: 4713-GMC10X7R105K25NTCT-ND; Temperature Coefficient: X7R; Thickness (Max): 0.037" (0.95mm); Tolerance: ±10%; value: 1 µF; Voltage - Rated: 25V
C20 = C0603C103K4RECTU: CAP CER 0603 10NF 16V X7R 10%; manufacturer: KEMET; Part Number: C0603C103K4RECTU; Capacitance: 10000 pF; Applications: ESD Protection; componentlink1description: Datasheet; componentlink1url: https://search.kemet.com/download/datasheet/C0603C103K4REC7867; componentlink2description: DigiKey Link; componentlink2url: https://www.digikey.com/en/products/detail/kemet/C0603C103K4RECTU/8643658; Device Package: 0603 (1608 Metric); lastupdated: 6.04.2026 19:17:55; Lifecycle Status: Active; Minimum Order: 1; Mounting Type: Surface Mount, MLCC; Operating Temperature: -55°C ~ 125°C; Package / Case: 0603 (1608 Metric); packaging: TapeAndReel; partid: 66152; price: 0.01; series: ESD SMD Comm X7R; Size / Dimension: 0.063" L x 0.031" W (1.60mm x 0.80mm); Supplier 1: DigiKey; Supplier Part Number 1: 399-C0603C103K4RECTUCT-ND; Temperature Coefficient: X7R; Thickness (Max): 0.034" (0.87mm); Tolerance: ±10%; value: 10000 pF; Voltage - Rated: 16V
D3 D4 = LTST-C191KRKT_2: Red 631nm LED Indication - Discrete 2V 0603 (1608 Metric); Manufacturer: Lite-On Inc.; Order Code: DIGI: 160-1447-2-ND; Manufacturer Part Number: LTST-C191KRKT
FB1 = FB0402-120R@100M-500mA: as FB2 on sheet 04_CAN; Part Number: FB0402-120R@100M-500mA; Footprint Doc: 0402; LatestRevisionDate: 2014-01-10; Published: 2011-11-14; ComponentLink1Description: Datasheet; ComponentLink2Description: Supplier link; ComponentLink1URL: N.A.; ComponentLink2URL: N.A.; HelpURL: http://search.murata.co.jp/Ceramy/image/img/PDF/ENG/L0110S0100BLM15A_SN.pdf; Supplier 1: Digi-Key; Supplier Part Number 1: 490-1005-1-ND; Supplier 2: Farnell; Supplier Part Number 2: 151-5760; Component Class: Inductors; PartId: 100300099; Author: rsk
J2 = SWR201-NRTN-S03-SA-WH: Connector; Manufacturer_Name: Sullins; Datasheet Link: https://drawings-pdf.s3.amazonaws.com/11623.pdf; Height: 6.3mm; Manufacturer_Part_Number: SWR201-NRTN-S03-SA-WH
J3 = FTSH-105-01-F-DV-K: Connector Header Surface Mount 10 position 0.050" (1.27mm); Order Code: DIGI: SAM8796-ND; Manufacturer Part Number: FTSH-105-01-F-DV-K
MTG1-MTG4 = MTG2MM
R6-R9 = RMCF0402FT10K0: RES 10K OHM 1% 1/16W 0402; Manufacturer: Stackpole Electronics Inc; Power (Watts): 0.063W, 1/16W; Temperature Coefficient: ±100ppm/°C; Part Number: RMCF0402FT10K0; Value: 10 kOhms; ComponentLink1Description: Datasheet; ComponentLink1URL: https://www.seielect.com/catalog/sei-rmcf_rmcp.pdf; ComponentLink2Description: DigiKey Link; ComponentLink2URL: https://www.digikey.com/en/products/detail/stackpole-electronics-inc/RMCF0402FT10K0/1761433; Composition: Thick Film; Device Package: 0402 (1005 Metric); Features: Automotive AEC-Q200; Height - Seated (Max): 0.016" (0.40mm); LastUpdated: 9.02.2024 20:29:20; Lifecycle Status: Active; Minimum Order: 1; Number of Terminations: 2; Operating Temperature: -55°C ~ 155°C; Package / Case: 0402 (1005 Metric); Packaging: CutTape; PartId: 20541; Part Status: Active; Price: 0.01; Ratings: AEC-Q200; Resistance: 10 kOhms; Series: RMCF; Size / Dimension: 0.039" L x 0.020" W (1.00mm x 0.50mm); Supplier 1: DigiKey; Supplier Part Number 1: RMCF0402FT10K0CT-ND; Supplier Device Package: 0402; Tolerance: ±1%
R10 = RMCF0402ZT0R00: RES 0 OHM JUMPER 1/16W 0402; Manufacturer: Stackpole Electronics Inc; Power (Watts): 0.063W, 1/16W; Part Number: RMCF0402ZT0R00; Value: 0 Ohms; ComponentLink1Description: Datasheet; ComponentLink1URL: https://www.seielect.com/catalog/sei-rmcf_rmcp.pdf; ComponentLink2Description: DigiKey Link; ComponentLink2URL: https://www.digikey.com/en/products/detail/stackpole-electronics-inc/RMCF0402ZT0R00/1756905; Composition: Thick Film; Device Package: 0402 (1005 Metric); Features: Automotive AEC-Q200; Height - Seated (Max): 0.016" (0.40mm); LastUpdated: 9.02.2024 20:29:34; Lifecycle Status: Active; Minimum Order: 1; Number of Terminations: 2; Operating Temperature: -55°C ~ 155°C; Package / Case: 0402 (1005 Metric); Packaging: CutTape; PartId: 17627; Part Status: Active; Price: 0.01; Ratings: AEC-Q200; Resistance: 0 Ohms; Series: RMCF; Size / Dimension: 0.039" L x 0.020" W (1.00mm x 0.50mm); Supplier 1: DigiKey; Supplier Part Number 1: RMCF0402ZT0R00CT-ND; Supplier Device Package: 0402; Tolerance: Jumper
R11 R12 = RMCF0402FT1K00: RES 1K OHM 1% 1/16W 0402; Manufacturer: Stackpole Electronics Inc; Power (Watts): 0.063W, 1/16W; Temperature Coefficient: ±100ppm/°C; Part Number: RMCF0402FT1K00; Value: 1 kOhms; ComponentLink1Description: Datasheet; ComponentLink1URL: https://www.seielect.com/catalog/sei-rmcf_rmcp.pdf; ComponentLink2Description: DigiKey Link; ComponentLink2URL: https://www.digikey.com/en/products/detail/stackpole-electronics-inc/RMCF0402FT1K00/1761754; Composition: Thick Film; Device Package: 0402 (1005 Metric); Features: Automotive AEC-Q200; Height - Seated (Max): 0.016" (0.40mm); LastUpdated: 9.02.2024 20:29:20; Lifecycle Status: Active; Minimum Order: 1; Number of Terminations: 2; Operating Temperature: -55°C ~ 155°C; Package / Case: 0402 (1005 Metric); Packaging: CutTape; PartId: 20544; Part Status: Active; Price: 0.01; Ratings: AEC-Q200; Resistance: 1 kOhms; Series: RMCF; Size / Dimension: 0.039" L x 0.020" W (1.00mm x 0.50mm); Supplier 1: DigiKey; Supplier Part Number 1: RMCF0402FT1K00CT-ND; Supplier Device Package: 0402; Tolerance: ±1%
U4 = STM32F103C8T6: ARM Cortex-M3 32-bit MCU, 64 KB Flash, 20 KB Internal RAM, 37 I/Os, 48-pin LQFP, -40 to 85 degC, Tray; Operating Frequency(F) (Processor speed) (MHz): 72; Supply Voltage(Vcc) min (V): 2; FLASH Size (Prog) (kB): 64; Internal RAM Size (kB): 20; I/Os (High Current): 37; A/D Converter: 2x12-bit (10 Channel); Core: ARM Cortex-M3; ComponentLink2Description: Datasheet; ComponentLink3Description: Package Specification; Mounting Technology: Surface Mount; ComponentLink3URL: http://www.st.com/st-web-ui/static/active/en/resource/technical/document/datasheet/DM00058181.pdf; DatasheetVersion: Rev. 16; ComponentLink1URL: http://www.st.com/web/en/home.html; ComponentLink1Description: Manufacturer URL; Manufacturer Part Number: STM32F103C8T6; Packing: Tray; PackageVersion: Rev. 6, 06/2013; PackageReference: LQFP48; PackageDescription: 48-Pin Low Profile Quad Flat Package, 7 x 7 mm Body, 0.5 mm Pitch; ComponentLink2URL: http://www.st.com/st-web-ui/static/active/en/resource/technical/document/datasheet/CD00161566.pdf; LCSC Part Number: C8734; LCSC Manufacturer Part Number: STM32F103C8T6
Y1 = ECS-80-8-30Q-VS-TR: 8 MHz Â±30ppm Crystal 8pF 100 Ohms 2-SMD, No Lead; MF: ECS Inc.; SnapEDA_Link: https://www.snapeda.com/parts/ECS-80-8-30Q-VS-TR/ECS/view-part/?ref=snap; Package: SMD-2 ECS Inc.; Value: *; MP: ECS-80-8-30Q-VS-TR; Check_prices: https://www.snapeda.com/parts/ECS-80-8-30Q-VS-TR/ECS/view-part/?ref=eda

## Sheet 06_NFC.SchDoc: HW_ADHERENT_NFC_R1
size A3; Organization: ASISGUARD; Address1: Kemalpasa, Kemalpasa Cd. No:290 D:292H, 35060 Bornova/Izmir/Turkey; SheetNumber: 6; SheetTotal: 6
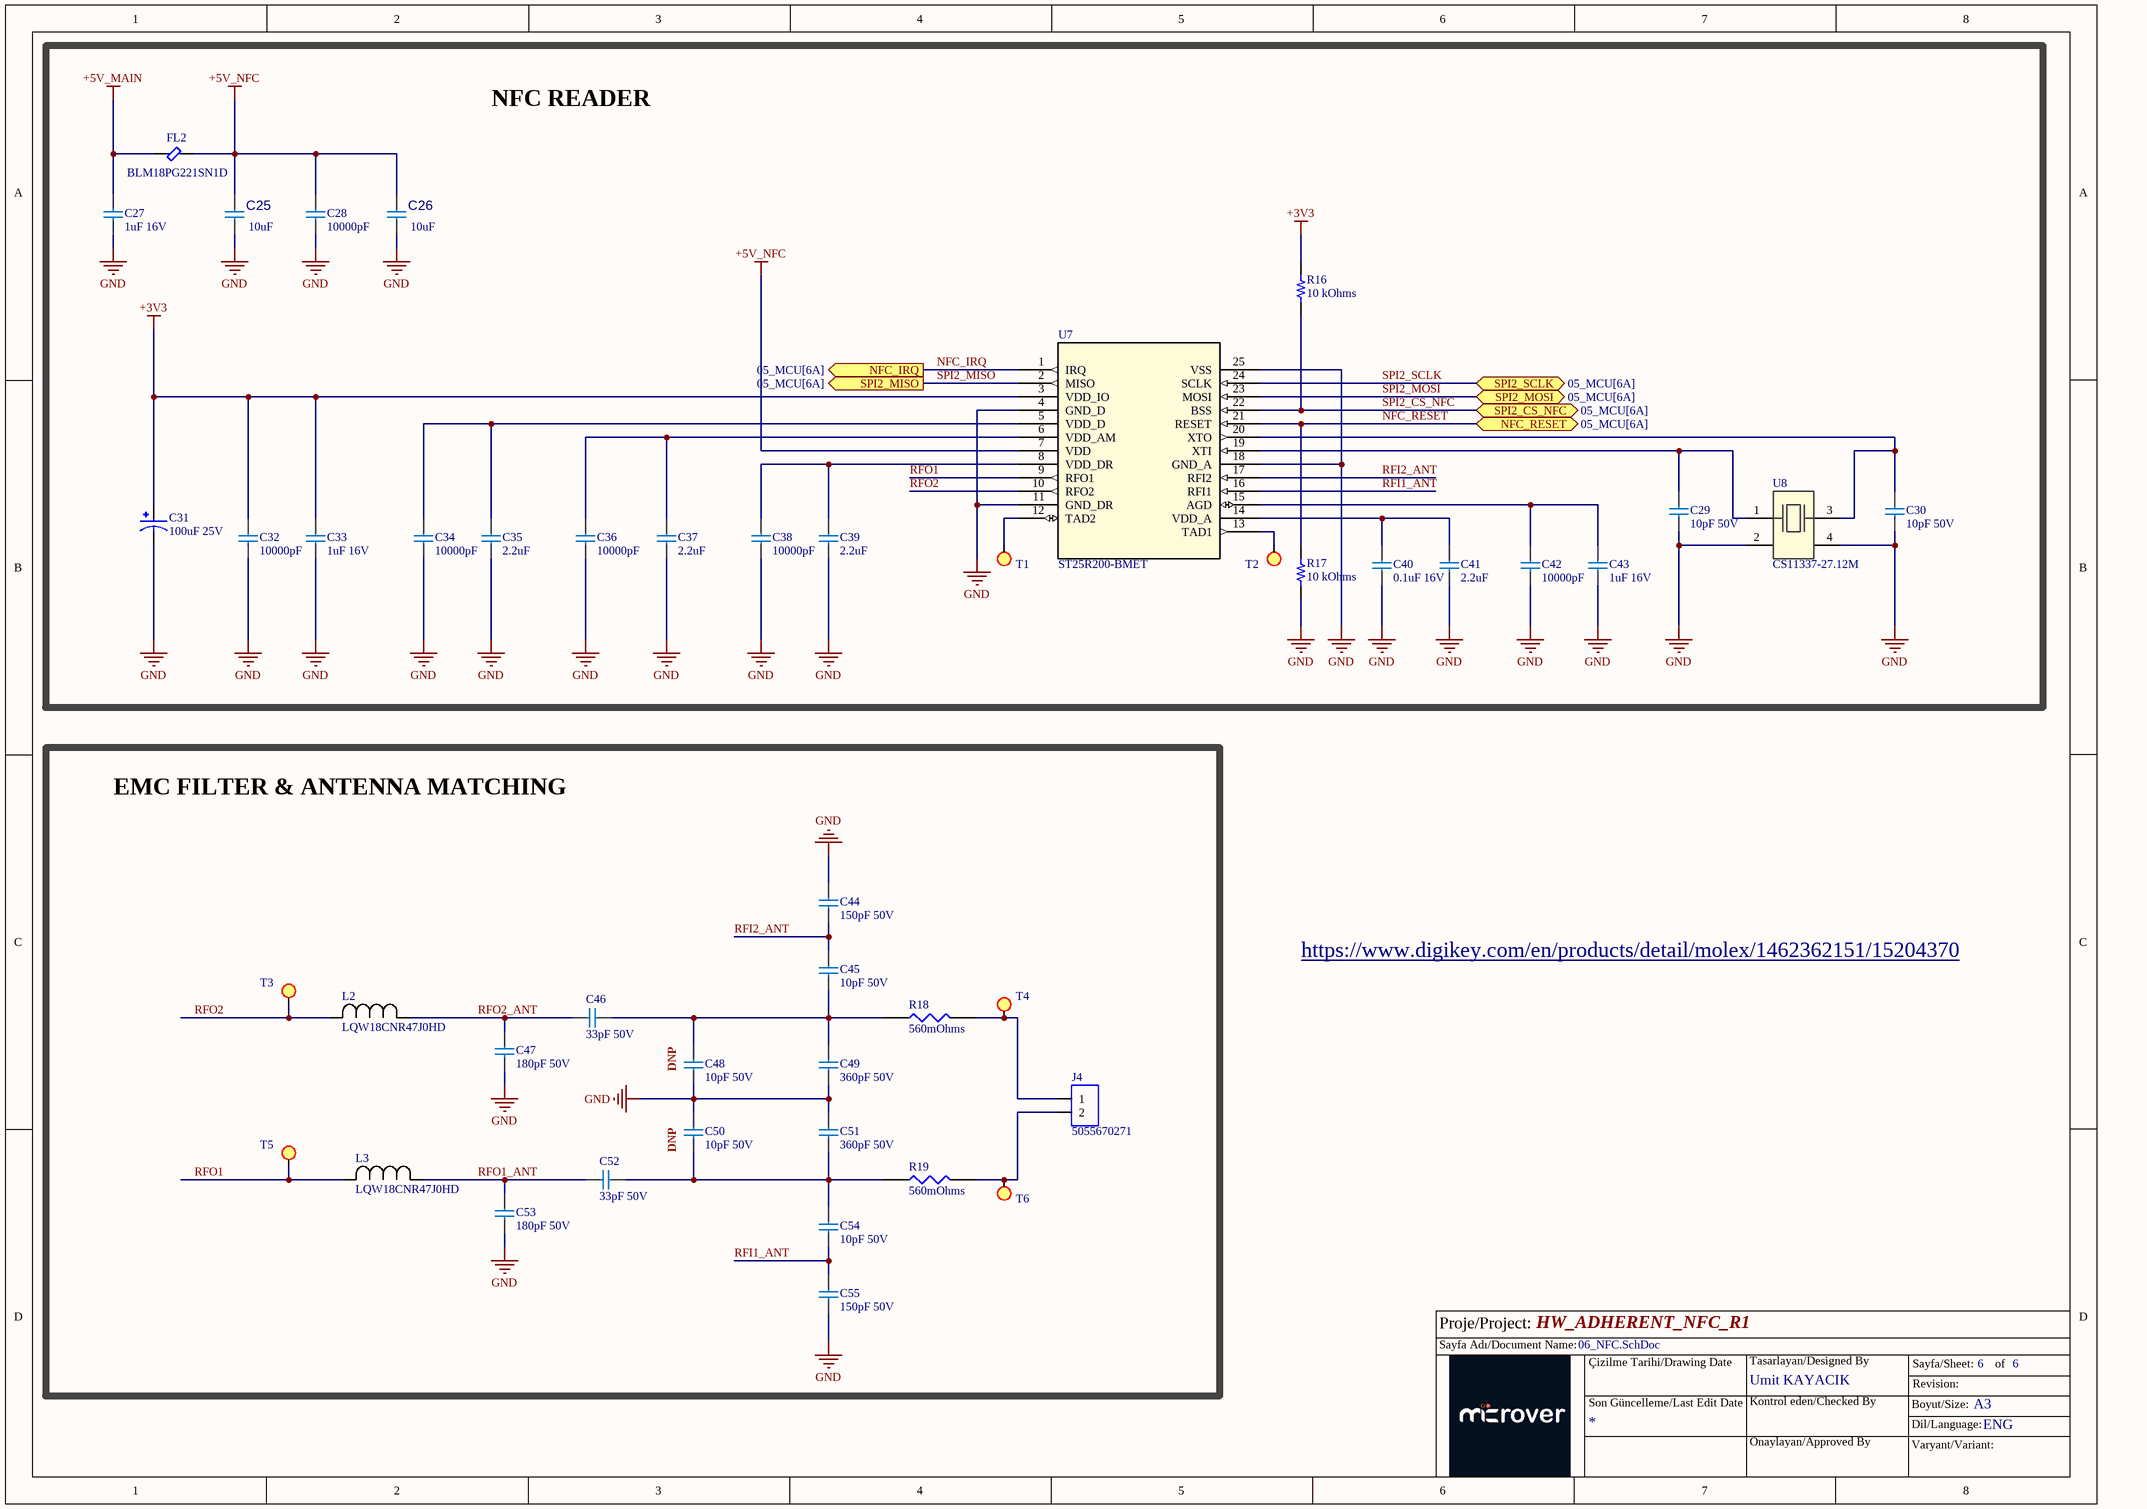
[diagram p4: 06_NFC.SchDoc]

### Parts
C25  10uF  [CAPC1608X100N]
C26  10uF  [CAPC1608X100N]
C27  1uF 16V  [CAPC1608X100N]
C28  10000pF  [CAPC1608X100N]
C29  10pF 50V  [CAPC1608X100N]
C30  10pF 50V  [CAPC1608X100N]
C31  100uF 25V  [CAP_25SVPF100M]
C32  10000pF  [CAPC1608X100N]
C33  1uF 16V  [CAPC1608X100N]
C34  10000pF  [CAPC1608X100N]
C35  2.2uF  [CAPC1608X100N]
C36  10000pF  [CAPC1608X100N]
C37  2.2uF  [CAPC1608X100N]
C38  10000pF  [CAPC1608X100N]
C39  2.2uF  [CAPC1608X100N]
C40  0.1uF 16V  [CAPC1608X100N]
C41  2.2uF  [CAPC1608X100N]
C42  10000pF  [CAPC1608X100N]
C43  1uF 16V  [CAPC1608X100N]
C44  150pF 50V  [CAPC1005X04L]
C45  10pF 50V  [CAPC1005X04L]
C46  33pF 50V  [CAPC1005X04L]
C47  180pF 50V  [CAPC1005X04L]
C48  10pF 50V  [CAPC1005X04L]
C49  360pF 50V  [CAPC1005X04L]
C50  10pF 50V  [CAPC1005X04L]
C51  360pF 50V  [CAPC1005X04L]
C52  33pF 50V  [CAPC1005X04L]
C53  180pF 50V  [CAPC1005X04L]
C54  10pF 50V  [CAPC1005X04L]
C55  150pF 50V  [CAPC1005X04L]
FL2  BLM18PG221SN1D  [BEADC1608X95N]
J4  5055670271  [CONN_505567_02_MOL]
L2  LQW18CNR47J0HD  [IND_LQW18CN_0H_MUR]
L3  LQW18CNR47J0HD  [IND_LQW18CN_0H_MUR]
R16  10 kOhms  [RES 0603_1608]
R17  10 kOhms  [RES 0603_1608]
R18  560mOhms  [RES_0402]
R19  560mOhms  [RES_0402]
T1  SMD  [TEST_POINT]  (value not drawn)
T2  SMD  [TEST_POINT]  (value not drawn)
T3  SMD  [TEST_POINT]  (value not drawn)
T4  SMD  [TEST_POINT]  (value not drawn)
T5  SMD  [TEST_POINT]  (value not drawn)
T6  SMD  [TEST_POINT]  (value not drawn)
U7  ST25R200-BMET  [UFQFPN24_STM]
U8  CS11337-27.12M  [NX2016SA2712MHZEXS00ACS11337]

### Blocks framed on the sheet
NFC READER: C25-C43 FL2 R16 R17 T1 T2 U7 U8
EMC FILTER & ANTENNA MATCHING: C44-C55 J4 L2 L3 R18 R19 T3-T6

### Ports
NFC_IRQ (out, see 05_MCU[6A]), NFC_RESET (bidir, see 05_MCU[6A]), SPI2_CS_NFC (bidir, see 05_MCU[6A]), SPI2_MISO (out, see 05_MCU[6A]), SPI2_MOSI (bidir, see 05_MCU[6A]), SPI2_SCLK (bidir, see 05_MCU[6A])

### Nets
+3V3: C31.1 C32.2 C33.2 R16.2 U7.3(VDD_IO)
+5V_MAIN: C27.2 FL2.1
+5V_NFC: C25.2 C26.2 C28.2 FL2.2 U7.7(VDD)
GND: C25.1() C26.1() C27.1 C28.1 C29.1 C30.1 C31.2 C32.1 C33.1 C34.1 C35.1 C36.1 C37.1 C38.1 C39.1 C40.1 C41.1 C42.1 C43.1 C44.2 C47.1 C48.1 C49.1 C50.2 C51.2 C53.1 C55.1 R17.1 U7.4(GND_D) U7.11(GND_DR) U7.18(GND_A) U7.25(VSS) U8.2(GND_1) U8.4(GND_2)
NFC_IRQ: U7.1(IRQ) ; port NFC_IRQ
NFC_RESET: R17.2 U7.21(RESET) ; port NFC_RESET
RFI1_ANT: C54.1 C55.2 U7.16(RFI1)
RFI2_ANT: C44.1 C45.2 U7.17(RFI2)
RFO1: L3.1 T5.1(TP) U7.9(RFO1)
RFO1_ANT: C52.2 C53.2 L3.2
RFO2: L2.1 T3.1(TP) U7.10(RFO2)
RFO2_ANT: C46.2 C47.2 L2.2
SPI2_CS_NFC: R16.1 U7.22(BSS) ; port SPI2_CS_NFC
SPI2_MISO: U7.2(MISO) ; port SPI2_MISO
SPI2_MOSI: U7.23(MOSI) ; port SPI2_MOSI
SPI2_SCLK: U7.24(SCLK) ; port SPI2_SCLK
NetC29_2: C29.2 U7.19(XTI) U8.1(CRYSTAL_1)
NetC30_2: C30.2 U7.20(XTO) U8.3(CRYSTAL_2)
NetC34_2: C34.2 C35.2 U7.5(VDD_D)
NetC36_2: C36.2 C37.2 U7.6(VDD_AM)
NetC38_2: C38.2 C39.2 U7.8(VDD_DR)
NetC40_2: C40.2 C41.2 U7.14(VDD_A)
NetC42_2: C42.2 C43.2 U7.15(AGD)
NetC45_1: C45.1 C46.1 C48.2 C49.2 R18.1
NetC50_1: C50.1 C51.1 C52.1 C54.2 R19.1
NetJ4_1: J4.1 R18.2 T4.1(TP)
NetJ4_2: J4.2 R19.2 T6.1(TP)
NetT1_1: T1.1(TP) U7.12(TAD2)
NetT2_1: T2.1(TP) U7.13(TAD1)

### Notes on the sheet
- https://www.digikey.com/en/products/detail/molex/1462362151/15204370
- (near C48) DNP
- (near C50) DNP
- Proje/Project:
- Sayfa Adı/Document Name:
- Çizilme Tarihi/Drawing Date
- Umit KAYACIK
- Tasarlayan/Designed By
- Sayfa/Sheet:
- Revision:
- of
- Son Güncelleme/Last Edit Date
- Kontrol eden/Checked By
- Onaylayan/Approved By
- Boyut/Size:
- Varyant/Variant:
- Dil/Language:
- A3
- ENG

### Library data of the parts
C25 C26 = CAP1461: as C22 on sheet 04_CAN; Voltage: 25V; Revision: 1; Supplier Part Number: 490-7202-1-ND
C27 C33 C43 = VJ0603G105KXJCW1BC: Multilayer Ceramic Capacitors MLCC - SMD/SMT 0603 1.0uF 16volts X5R 10%
C28 C32 C34 C36 C38 C42 = C0603C103K4RECTU: 10000 pF ±10% 16V Ceramic Capacitor X7R 0603 (1608 Metric); Manufacturer: KEMET; Supplier: Digi; 399-C0603C103K4RECTUDKR-ND; JLCPCB PART#: 0603
C29 C30 = C0603C100F5GACAUTO: 10 pF ±1% 50V Ceramic Capacitor C0G, NP0 0603 (1608 Metric); Manufacturer: KEMET; Supplier: Digi; 399-C0603C100F5GACAUTODKR-ND
C31 = 25SVPF100M: 100 µF 25 V Aluminum - Polymer Capacitors Radial, Can - SMD 24mOhm 5000 Hrs @ 105°C; Manufacturer: Panasonic Industry; Supplier: Digi; P123675DKR-ND; JLCPCB PART#: C136279
C35 C37 C39 C41 = 0603X225K250CT: 2.2 µF ±10% 25V Ceramic Capacitor X5R 0603 (1608 Metric); Manufacturer: Walsin Technology Corporation; Supplier: Digi; 1292-0603X225K250CTDKR-ND; JLCPCB PART#: C237194
C40 = VJ0603Y104KXJAC: 0.1 µF ±10% 16V Ceramic Capacitor X7R 0603 (1608 Metric); Manufacturer: Vishay Vitramon; Supplier: Digi; 720-1377-6-ND
C44 C55 = GMC04CG151G50NT: 150 pF ±2% 50V Ceramic Capacitor C0G, NP0 0402 (1005 Metric); Manufacturer: Cal-Chip Electronics, Inc.; Supplier: Digi; 2571-GMC04CG151G50NTTR-ND
C45 C48 C50 C54 = GMC04CG100G50NT: CAP0402 COG 10PF 2% 50V; Manufacturer: Cal-Chip Electronics, Inc.; Supplier: Digi; 4713-GMC04CG100G50NTDKR-ND
C46 C52 = GMC04CG330F50NT: 33 pF ±1% 50V Ceramic Capacitor C0G, NP0 0402 (1005 Metric); Manufacturer: Cal-Chip Electronics, Inc.; Supplier: Digi; 2571-GMC04CG330F50NTTR-ND
C47 C53 = GMC04CG181F50NT: 180 pF ±1% 50V Ceramic Capacitor C0G, NP0 0402 (1005 Metric)
C49 C51 = GMC04CG361J50NT: 360 pF ±5% 50V Ceramic Capacitor C0G, NP0 0402 (1005 Metric); Manufacturer: Cal-Chip Electronics, Inc.; Supplier: Digi; 4713-GMC04CG361J50NTDKR-ND
FL2 = BLM18PG221SN1D: 220 Ohms @ 100 MHz 1 Power Line Ferrite Bead 0603 (1608 Metric) 1.4A 100mOhm; MF: Murata; MP: BLM18PG221SN1D; Value: *; Availability: Unavailable; SnapEDA_Link: https://www.snapeda.com/parts/BLM18PG221SN1D/Murata/view-part/236838/?ref=snap; Price: None; Package: 1608 Murata
J4 = 5055670271: Connector Header Surface Mount, Right Angle 2 position 0.049" (1.25mm); Manufacturer: Molex; Supplier: Digi; WM17038DKR-ND
L2 L3 = LQW18CNR47J0HD: Description; Manufacturer_Name: Murata; Copyright: Copyright (C) 2025 Ultra Librarian. All rights reserved.; Manufacturer_Part_Number: LQW18CNR47J0HD
R16 R17 = RNCS0603BKE10K0_1: RES 10K OHM 0.1% 1/16W 0603; Manufacturer: Stackpole Electronics Inc; Power (Watts): 0.063W, 1/16W; Temperature Coefficient: ±25ppm/°C; Part Number: RNCS0603BKE10K0; Value: 10 kOhms; ComponentLink1Description: Datasheet; ComponentLink1URL: https://www.seielect.com/catalog/sei-rncs_rnch.pdf; ComponentLink2Description: DigiKey Link; ComponentLink2URL: https://www.digikey.com/en/products/detail/stackpole-electronics-inc/RNCS0603BKE10K0/1708836; Composition: Thin Film; Device Package: 0603 (1608 Metric); Features: Anti-Corrosive, Automotive AEC-Q200, Moisture Resistant; Height - Seated (Max): 0.022" (0.55mm); LastUpdated: 2/9/2024 8:43:37 PM; Lifecycle Status: Active; Minimum Order: 1; Number of Terminations: 2; Operating Temperature: -55°C ~ 155°C; Package / Case: 0603 (1608 Metric); Packaging: TapeAndReel; PartId: 4838; Part Status: Active; Price: 0.06; Ratings: AEC-Q200; Resistance: 10 kOhms; Series: RNCS; Size / Dimension: 0.061" L x 0.031" W (1.55mm x 0.80mm); Supplier 1: DigiKey; Supplier Part Number 1: RNCS0603BKE10K0CT-ND; Supplier Device Package: 0603; Tolerance: ±0.1%
R18 R19 = RLP73K1ER56FTDF: 560 mOhms ±1% 0.125W, 1/8W Chip Resistor 0402 (1005 Metric) Current Sense Thick Film; Manufacturer: TE Connectivity Passive Product; Supplier: Digi; A109550DKR-ND
T1-T6 = TP: DESIG: testing PAD; FAB: NA; VAL: NOT POPULATED; PCB Footprint: test0_8-smd; REF: NA
U7 = ST25R200-BMET: Powerful general-purpose NFC reader for consumer and industrial applications; Manufacturer_Name: STMicroelectronics; Copyright: Copyright (C) 2025 Ultra Librarian. All rights reserved.; Manufacturer_Part_Number: ST25R200-BMET; RefDes: RefDes; Type: Type
U8 = CS11337-27.12M: 27.12 MHz ±30ppm Crystal 6pF 60 Ohms 4-SMD, No Lead; Manıfacturer: NDK (NIHON DEMPA KOGYO CO., LTD); Supplier: 644-CS11337-27.12MDKR-ND

## Nets that join several sheets
+3V3: 03_POWER (5 pins), 04_CAN (FB2.1), 05_MCU (13 pins), 06_NFC (5 pins)
+5V_MAIN: 03_POWER (7 pins), 06_NFC (C27.2 FL2.1)
GND: 03_POWER (17 pins), 04_CAN (6 pins), 05_MCU (22 pins), 06_NFC (34 pins)
CAN1_N: 03_POWER (J1.4), 04_CAN (C24.2 FL1.3 R14.1)
CAN1_P: 03_POWER (J1.3), 04_CAN (C21.1 FL1.4 R13.1)
CAN_RX: 04_CAN (U5.4), 05_MCU (U4.32)
CAN_TX: 04_CAN (U5.1), 05_MCU (U4.33)
NetC3_2: 03_POWER (C3.2 R1.1 R2.2), 05_MCU (U4.11)
NetR15_2: 04_CAN (R15.2), 05_MCU (U4.14)
NFC_IRQ: 05_MCU (U4.22), 06_NFC (U7.1)
NFC_RESET: 05_MCU (U4.21), 06_NFC (R17.2 U7.21)
SPI2_CS_NFC: 05_MCU (U4.25), 06_NFC (R16.1 U7.22)
SPI2_MISO: 05_MCU (U4.27), 06_NFC (U7.2)
SPI2_MOSI: 05_MCU (U4.28), 06_NFC (U7.23)
SPI2_SCLK: 05_MCU (U4.26), 06_NFC (U7.24)

## Assembly variants
Variant of HW_ADHERENT_NFC_R1: all parts fitted